# Altium project BTL_DTTT1_Project1.PrjPCB
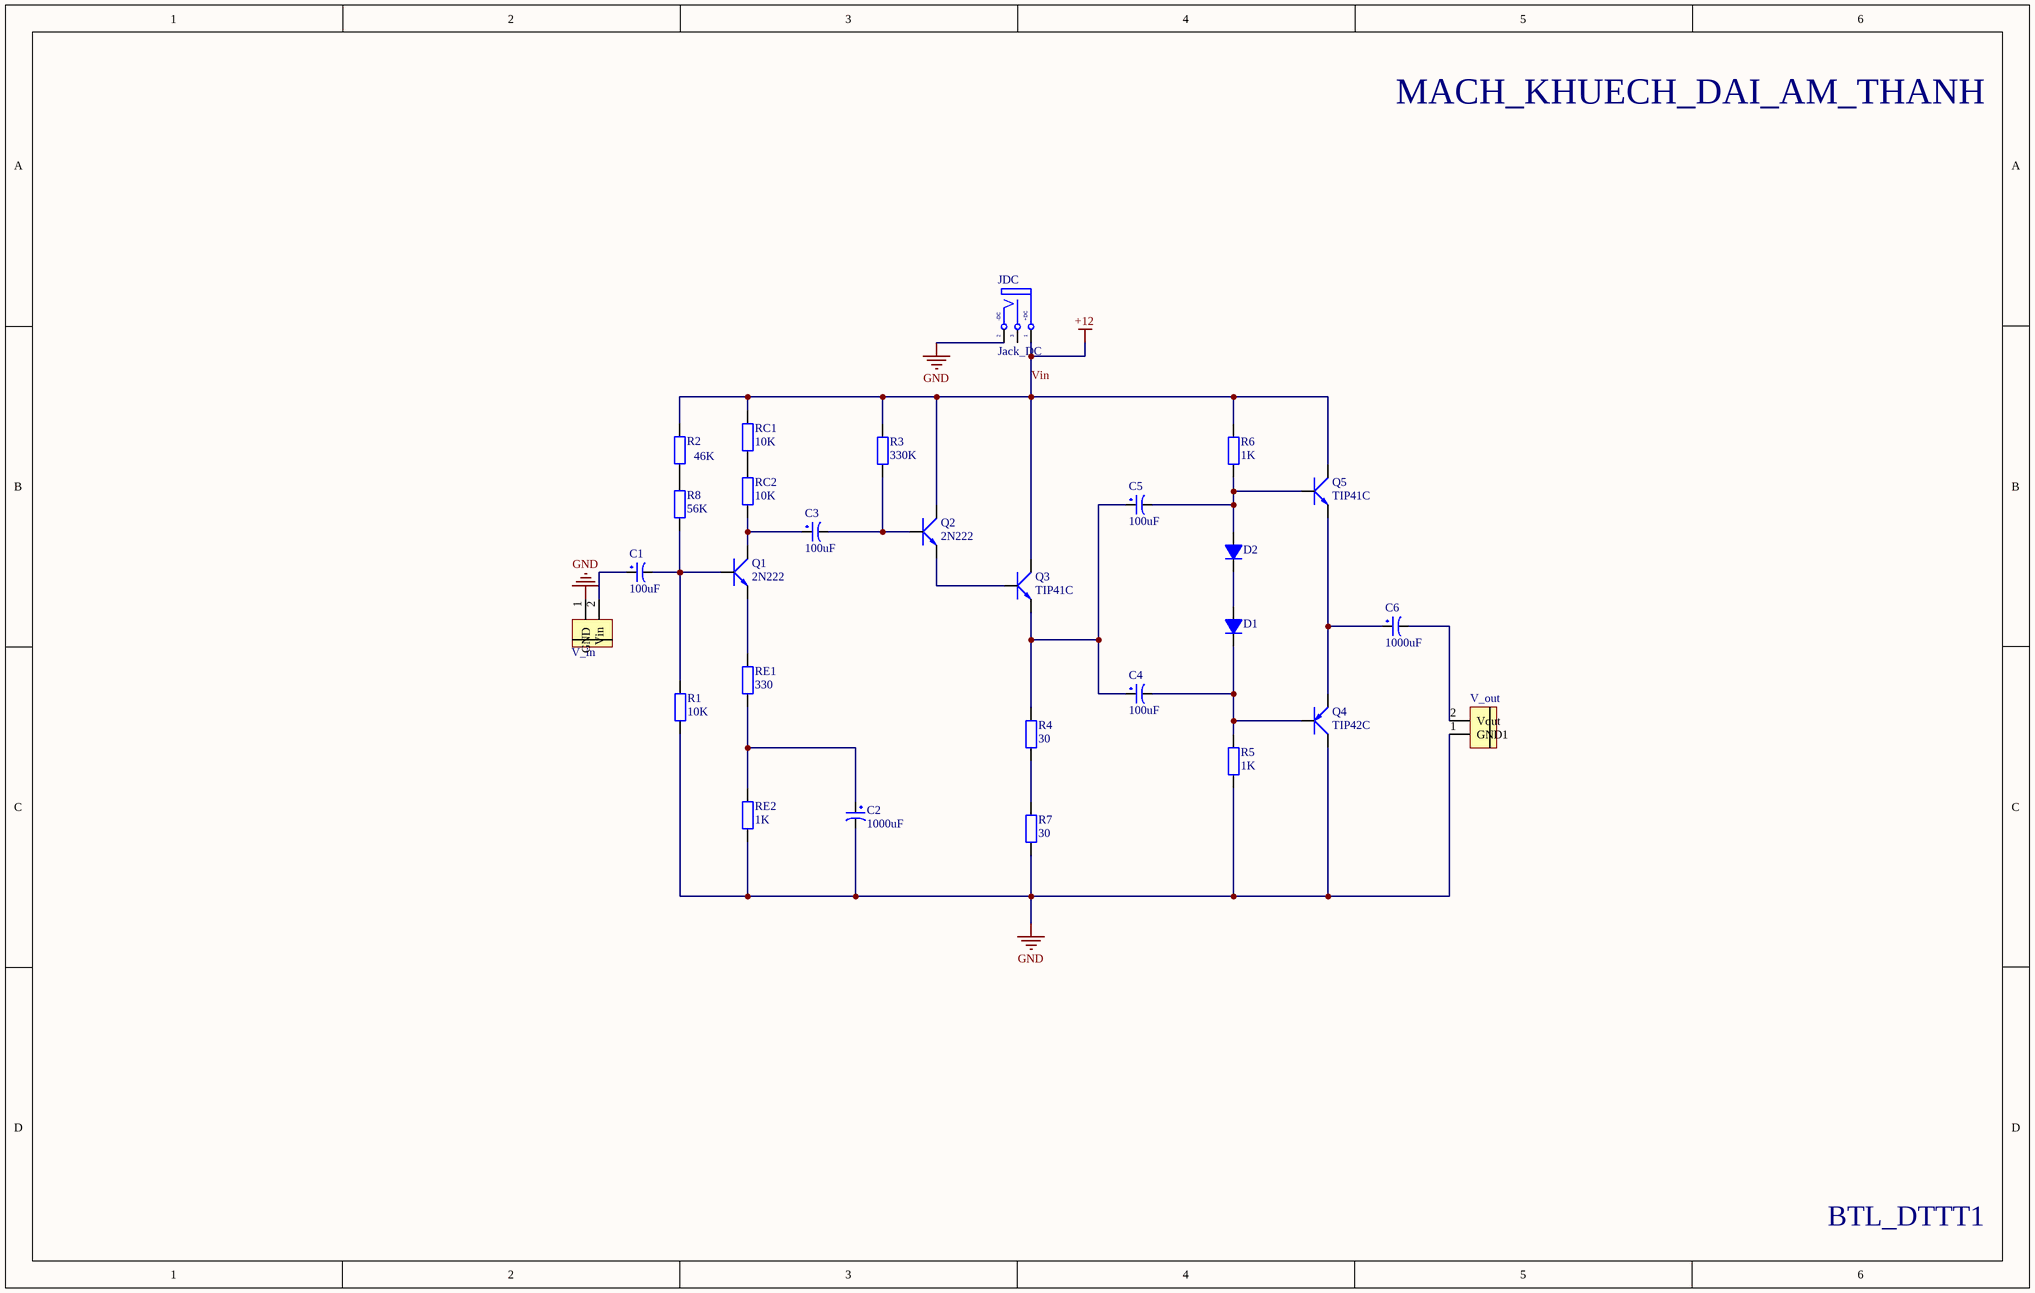
[diagram p0: mach_nguyen_li_dttt1.SchDoc]
1 sheet, 28 parts. Net scope: global (net labels, ports and power ports of the same name join across sheets).
Board file: PCB_DTTT1.PcbDoc

## Sheet mach_nguyen_li_dttt1.SchDoc
size 381 x 241 mm

### Parts
C1  100uF  [tu hoa 5mm]
C2  1000uF  [tu hoa 13mm]
C3  100uF  [tu hoa 5mm]
C4  100uF  [tu hoa 5mm]
C5  100uF  [tu hoa 5mm]
C6  1000uF  [tu hoa 13mm]
D1  100v  [DIODE 1A]  (value not drawn)
D2  100v  [DIODE 1A]  (value not drawn)
JDC  Jack_DC  [DC-IN_DC050-T]
Q1  2N222  [TO92-123]
Q2  2N222  [TO92-123]
Q3  TIP41C  [TO220-123]
Q4  TIP42C  [TO220-123]
Q5  TIP41C  [TO220-123]
R1  10K  [tro vach 1/2w]
R2  46K  [tro vach 1/2w]
R3  330K  [tro vach 1/2w]
R4  30  [tro vach 1/2w]
R5  1K  [tro vach 1/2w]
R6  1K  [tro vach 1/2w]
R7  30  [tro vach 1/2w]
R8  56K  [tro vach 1/2w]
RC1  10K  [tro vach 1/2w]
RC2  10K  [tro vach 1/2w]
RE1  330  [tro vach 1/2w]
RE2  1K  [tro vach 1/2w]
V_in  CON 2 KF301  [Con 2 KF301 5.08]  (value not drawn)
V_out  CON 2 KF301  [Con 2 KF301 5.08]  (value not drawn)

### Nets
GND: C2.2 JDC.2(TN) Q4.2(C) R1.1 R5.1 R7.1 RE2.1 V_in.1(GND) V_out.1(GND1)
Vin: JDC.1(T) Q2.3(C) Q3.2(C) Q5.2(C) R2.2 R3.2 R6.2 RC1.2  [also labelled +12]
NetC1_1: C1.1 V_in.2(Vin)
NetC1_2: C1.2 Q1.2(B) R1.2 R8.1
NetC2_1: C2.1 RE1.1 RE2.2
NetC3_1: C3.1 Q1.3(C) RC2.1
NetC3_2: C3.2 Q2.2(B) R3.1
NetC4_1: C4.1 C5.1 Q3.3(E) R4.2
NetC4_2: C4.2 D1.2(K) Q4.1(B) R5.2
NetC5_2: C5.2 D2.1(A) Q5.1(B) R6.1
NetC6_1: C6.1 Q4.3(E) Q5.3(E)
NetC6_2: C6.2 V_out.2(Vout)
NetD1_1: D1.1(A) D2.2(K)
NetQ1_1: Q1.1(E) RE1.2
NetQ2_1: Q2.1(E) Q3.1(B)
NetR2_1: R2.1 R8.2
NetR4_1: R4.1 R7.2
NetRC1_1: RC1.1 RC2.2

Not connected (* = marked no-connect by the designer): JDC 3(S)

### Notes on the sheet
- MACH_KHUECH_DAI_AM_THANH
- BTL_DTTT1
- (in symbol DC050-T) -DC; +DC

### Library data of the parts
C1 C3-C5 = Tu Hoa 100uF 16V 5x11: Cắm; Don_Vi: Con; So_Chan: 2; Ten_Linh_Kien: Tụ Hóa 100uF 16V 5x11MM; Ma_Hang: MH008417; Chung_Loai: Cắm; Kieu_Chan: *
C2 C6 = Tu Hoa 1000uF 25V 13x21: Cắm; Don_Vi: Con; So_Chan: 2; Ten_Linh_Kien: Tụ Hóa 1000uF 25V 13x21MM; Ma_Hang: MH002315; Chung_Loai: Cắm; Kieu_Chan: *
D1 D2 = Diode 1N4007: Cắm; Ten_Linh_Kien: Diode 1N4007 1A (DIP); Don_Vi: Con; Ma_Hang: MH001063; Ghi Chu: *; Kieu_Chan: *; Chung_Loai: Cắm
JDC = DC050-T: Surface Mount，Right Angle DC Power Receptacle 2mm 6.4mm 4A 16V SMD AC/DC Power Connectors ROHS; Manufacture: SHOU HAN; Link sale: #https://www.lcsc.com/product-detail/AC-DC-Power-Connectors_SHOU-HAN-DC050-T_C431534.html#; Partnumber: DC050-T; Value: Jack_DC; Creator: Manhpd; Category: Connector; Mounting type: Surface Mount; Detailed Value: Jack_DC
Q1 Q2 = 2N222: NPN 600mW, ECB; Value: C1815
Q3 Q5 = TIP41C: NPN 2W, BCE; Value: TIP41C
Q4 = TIP42C: PNP 2W, BCE; Value: TIP42C
R1-R8 RC1 RC2 RE1 RE2 = Tro Vach 1/2W 5% 820R: Cắm; Don_Vi: Con; So_Chan: 2; Ten_Linh_Kien: Trở 5% 1/2w 820R; Ma_Hang: MH006202; Chung_Loai: Cắm; Kieu_Chan: *
V_in V_out = CON 2 KF301: Cắm; Ma_Hang: MH000987; Ten_Linh_Kien: CON 2 KF301-2P 5.08MM Xanh Dương; Chung_Loai: Cắm; Ghi_Chu: *; Kieu_Chan: *; Don_Vi: Con